# EAGLE design Light_box_v2 (EAGLE 9.6.2)
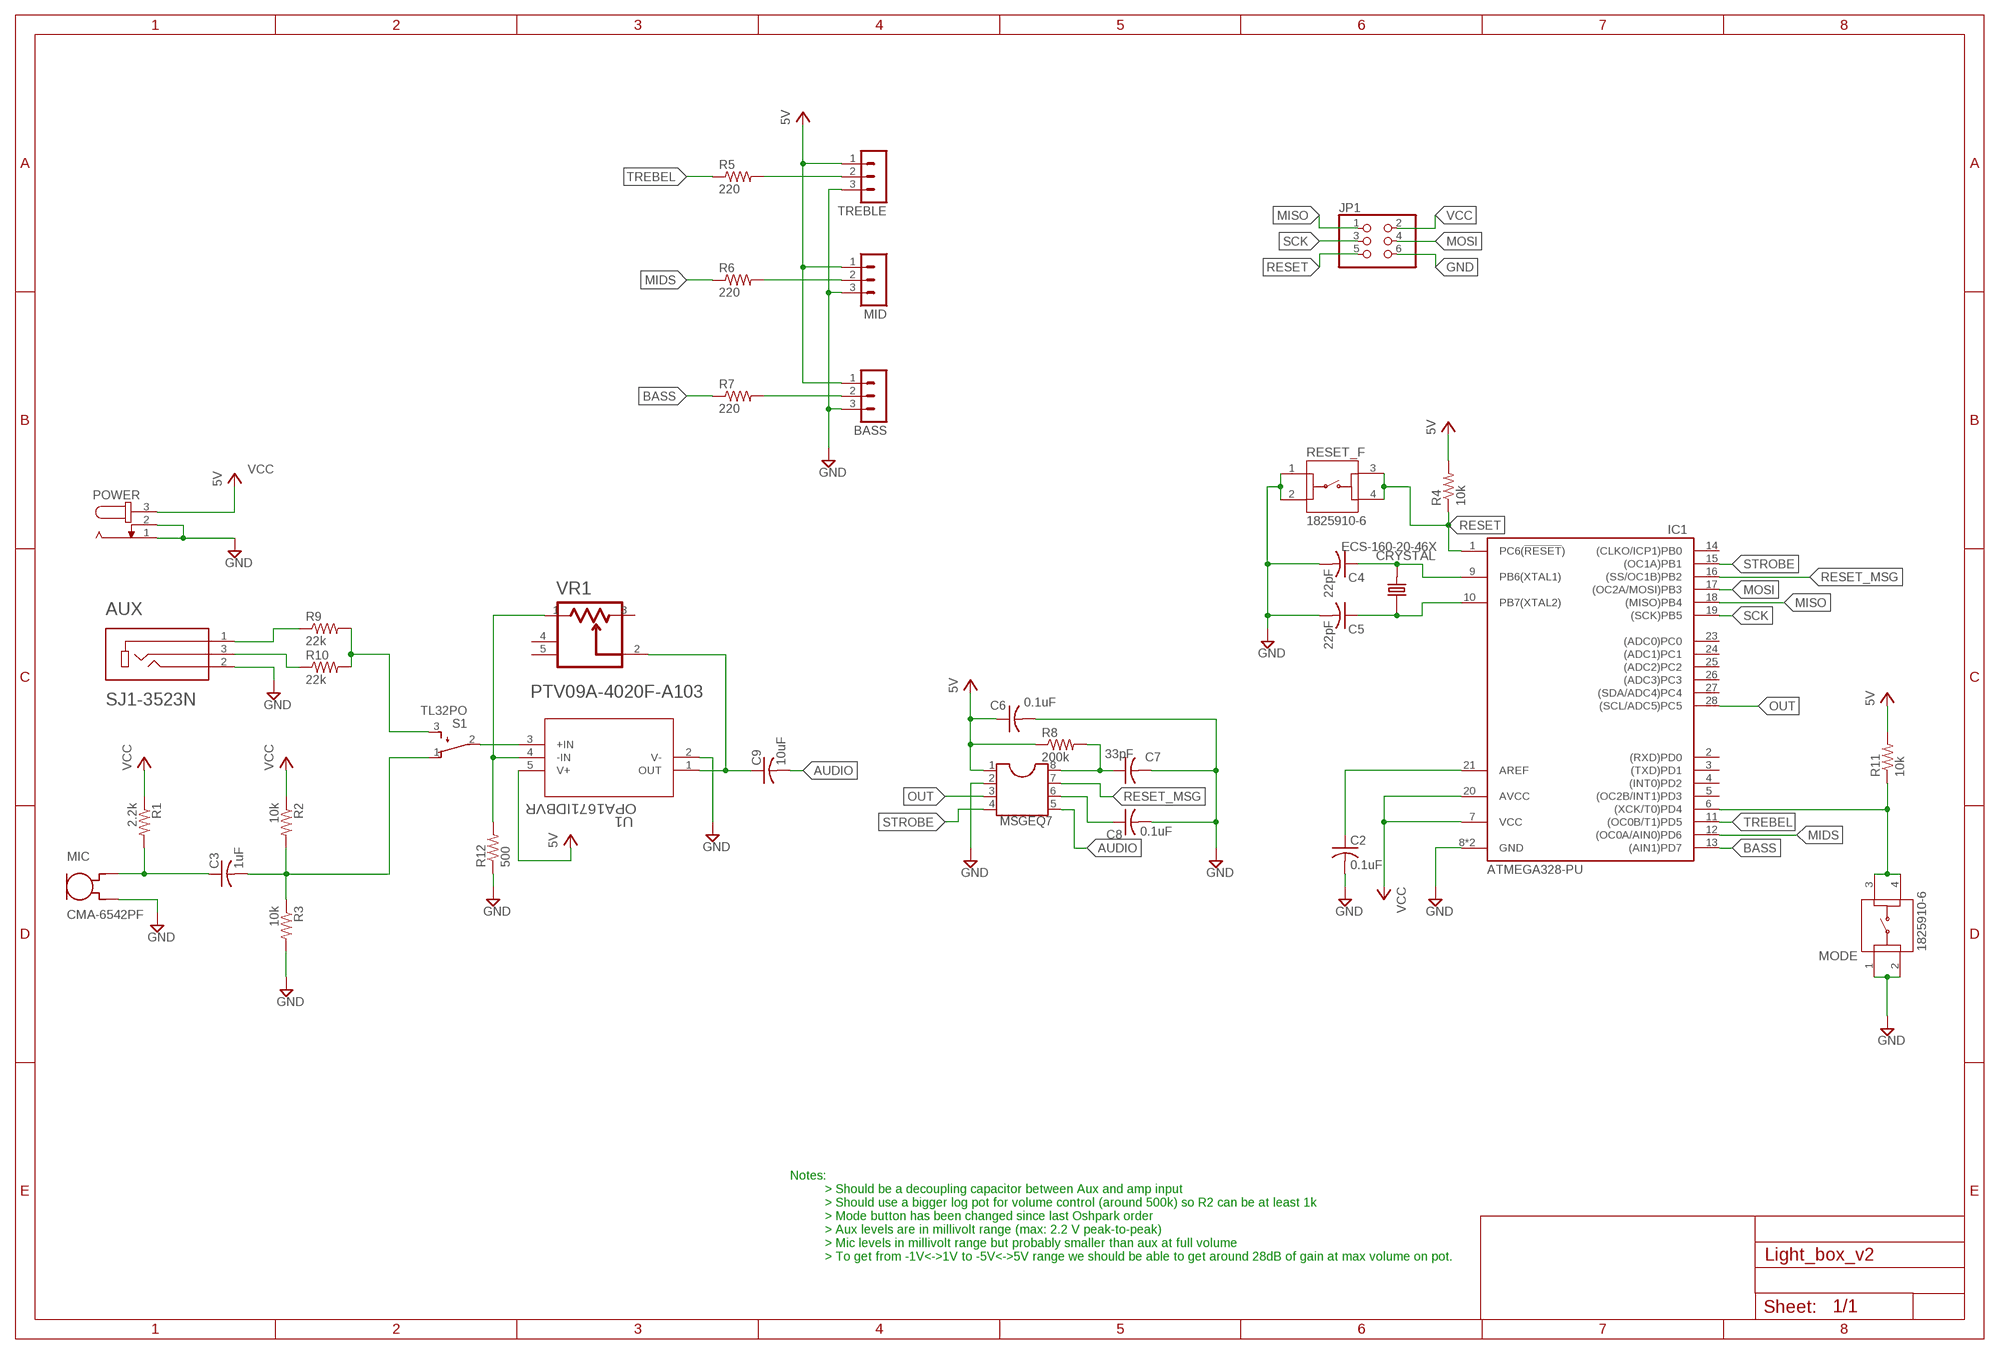
[diagram p0: schematic, sheet 1]

## Parts
AUX  SJ1-3523N  [CUI_SJ1-3523N]
BASS  MA03-1  [MA03-1]
C2  0.1uF  C-USC0805  [C0805]
C3  1uF  C-USC0805  [C0805]
C4  22pF  C-USC0805  [C0805]
C5  22pF  C-USC0805  [C0805]
C6  0.1uF  C-USC0805  [C0805]
C7  33pF  C-USC0805  [C0805]
C8  0.1uF  C-USC0805  [C0805]
C9  10uF  C-USC0805  [C0805]
CRYSTAL  ECS-160-20-46X  [XTAL_ECS-160-20-46X]
IC1  ATMEGA328-PU  [DIL28]
JP1  PINHD-2X3  [2X03]
MIC  CMA-6542PF  [CUI_CMA-6542PF]
MID  MA03-1  [MA03-1]
MODE  1825910-6  [SW_1825910-6-4]
MSGEQ7  DIL8  [DIL08]
POWER  JACK-PLUG1  [SPC4078]
R1  2.2k  R-US_R0805  [R0805]
R2  10k  R-US_R0805  [R0805]
R3  10k  R-US_R0805  [R0805]
R4  10k  R-US_R0805  [R0805]
R5  220  R-US_R0805  [R0805]
R6  220  R-US_R0805  [R0805]
R7  220  R-US_R0805  [R0805]
R8  200k  R-US_R0805  [R0805]
R9  22k  R-US_R0805  [R0805]
R10  22k  R-US_R0805  [R0805]
R11  10k  R-US_R0805  [R0805]
R12  500  R-US_R0805  [R0805]
RESET_F  1825910-6  [SW_1825910-6-4]
S1  TL32PO  [TL3XPO]
TREBLE  MA03-1  [MA03-1]
U1  OPA1671IDBVR  [SOT23-DBV5_TEX]
VR1  BOURNS_PTV09A-4020F-A103BOURNS_PTV09A-4020F-A103_0_0  [BOURNS_PTV09A-4020F-A103_0]

## Nets
AUDIO: C9.2 MSGEQ7.5
BASS: IC1.13((AIN1)PD7) R7.1
GND: AUX.2 BASS.3 C2.2 C4.2 C5.2 C6.2 C7.2 C8.2 IC1.8(GND) IC1.22(GND) JP1.6 MIC.GND MID.3 MODE.1 MODE.2 MSGEQ7.2 POWER.1 POWER.2 R3.2 R12.1 RESET_F.1 RESET_F.2 TREBLE.3 U1.2(V-)
MIDS: IC1.12((OC0A/AIN0)PD6) R6.1
MISO: IC1.18((MISO)PB4) JP1.1
MOSI: IC1.17((OC2A/MOSI)PB3) JP1.4
N$1: C3.1 MIC.OUT R1.2
N$2: C3.2 R2.2 R3.1 S1.1(O)
N$3: AUX.1 R9.1
N$4: C4.1 CRYSTAL.2 IC1.9(PB6(XTAL1))
N$5: C5.1 CRYSTAL.1 IC1.10(PB7(XTAL2))
N$6: R5.2 TREBLE.2
N$7: C9.1 U1.1(OUT) VR1.2
N$8: MID.2 R6.2
N$9: BASS.2 R7.2
N$10: C7.1 MSGEQ7.8 R8.2
N$11: C8.1 MSGEQ7.6
N$12: AUX.3 R10.1
N$13: R12.2 U1.4(-IN) VR1.1
N$14: R9.2 R10.2 S1.3(S)
N$15: C2.1 IC1.21(AREF)
N$16: S1.2(P) U1.3(+IN)
N$22: IC1.6((XCK/T0)PD4) MODE.3 MODE.4 R11.1
OUT: IC1.28((SCL/ADC5)PC5) MSGEQ7.3
RESET: IC1.1(PC6(!RESET!)) JP1.5 R4.1 RESET_F.3 RESET_F.4
RESET_MSG: IC1.16((SS/OC1B)PB2) MSGEQ7.7
SCK: IC1.19((SCK)PB5) JP1.3
STROBE: IC1.15((OC1A)PB1) MSGEQ7.4
TREBEL: IC1.11((OC0B/T1)PD5) R5.1
VCC: BASS.1 C6.1 IC1.7(VCC) IC1.20(AVCC) JP1.2 MID.1 MSGEQ7.1 POWER.3 R1.1 R2.1 R4.2 R8.1 R11.2 TREBLE.1 U1.5(V+) ; supply symbol labelled 5V
Unconnected: IC1.2((RXD)PD0) IC1.3((TXD)PD1) IC1.4((INT0)PD2) IC1.5((OC2B/INT1)PD3) IC1.14((CLKO/ICP1)PB0) IC1.23((ADC0)PC0) IC1.24((ADC1)PC1) IC1.25((ADC2)PC2) IC1.26((ADC3)PC3) IC1.27((SDA/ADC4)PC4) VR1.3 VR1.4(MNT_1) VR1.5(MNT_2)

## Notes on the sheet
- Notes:
            > Should be a decoupling capacitor between Aux and amp input
            > Should use a bigger log pot for volume control (around 500k) so R2 can be at least 1k
            > Mode button has been changed since last Oshpark order
            > Aux levels are in millivolt range (max: 2.2 V peak-to-peak)
            > Mic levels in millivolt range but probably smaller than aux at full volume
            > To get from -1V<->1V to -5V<->5V range we should be able to get around 28dB of gain at max volume on pot.

## Library data of the parts
AUX = SJ1-3523N:SJ1-3523N: 3.5 mm Right-Angle Stereo Jack, 3 Pin PCB Mount, Non-Threaded; MANUFACTURER: CUI; PARTREV: 1.02; STANDARD: Manufacturer recommendation
BASS MID TREBLE = con-lstb:MA03-1: PIN HEADER; OC_FARNELL: unknown; OC_NEWARK: unknown
C2-C9 = rcl:C-US: CAPACITOR, American symbol; SPICEPREFIX: C
CRYSTAL = ECS-160-20-46X:ECS-160-20-46X: QUARTZ CRYSTAL T/H; DESCRIPTION: 16MHz ±30ppm Crystal 20pF 50 Ohms HC-46/X; DIGI-KEY_PART_NUMBER: XC1759-ND; DIGIKEY-PURCHASE-URL: https://snapeda.com/shop?store=DigiKey&id=628017; MF: ECS Inc.; MOUSER-PURCHASE-URL: https://snapeda.com/shop?store=Mouser&id=628017; MP: ECS-160-20-46X; PACKAGE: HC46/X ECS International
IC1 = ATMEGA328-PU:ATMEGA328-PU: Atmel ATmega48/88/168/328 AVR Microcontroller; DESCRIPTION: IC MCU 8BIT 32KB FLASH 28DIP; DIGIKEY-PURCHASE-URL: https://snapeda.com/shop?store=DigiKey&id=4833845; MF: Microchip Technology; MOUSER-PURCHASE-URL: https://snapeda.com/shop?store=Mouser&id=4833845; MP: ATMEGA328-PU; PACKAGE: None
JP1 = pinhead:PINHD-2X3: PIN HEADER
MIC = CMA-6542PF:CMA-6542PF: 9.7 mm, Omnidirectional, PCB Mount, 4.5 Vdc, Electret Condenser Microphone; CUI_PURCHASE_URL: https://www.cuidevices.com/product/audio/microphones/electret-condenser-microphones/cma-6542pf?utm_source=snapeda.com&utm_medium=referral&utm_campaign=snapedaBOM; DESCRIPTION: 9.7 mm, Omnidirectional, PCB Mount, 4.5 Vdc, Electret Condenser Microphone; DIGI-KEY_PART_NUMBER: 102-1720-ND; DIGIKEY-PURCHASE-URL: https://snapeda.com/shop?store=DigiKey&id=316835; MF: CUI Devices; MOUSER-PURCHASE-URL: https://snapeda.com/shop?store=Mouser&id=316835; MP: CMA-6542PF; PACKAGE: CUI Inc.
MODE RESET_F = 1825910-6:1825910-6: Switch Tactile OFF (ON) SPST Round Button PC Pins 0.05A 24VDC 100000Cycles 1.57N Thru-Hole Loose; COMMENT: 1825910-6; CONFIGURATION_POLE-THROW: Single Pole - Single Throw; CONTACT_CURRENT_RATING: 50 mA; DESCRIPTION: Switch Push Button OFF (ON) SPST Round Button 0.05A 24VDC Momentary Contact PC Pins Thru-Hole; DIGI-KEY_PART_NUMBER: 450-1650-ND; DIGIKEY-PURCHASE-URL: https://snapeda.com/shop?store=DigiKey&id=424522; EU_ROHS_COMPLIANCE: Compliant; MF: TE Connectivity; MP: 1825910-6; PACKAGE: None
MSGEQ7 = ic-package:DIL8: Dual In Line / Socket
POWER = con-jack:JACK-PLUG: DC POWER JACK Power Jack, DC, Right Angle, Through Hole, Rated 5A at 16VDC, PC Terminals Distributor: Farnell (www.Farnell.de) Drawing: 84N1161.pdf / 84N1162.pdf Manufacturer: SPC Technology (www.spctechnology.com) Type: SPC4077 / SPC 4078; OC_FARNELL: unknown; OC_NEWARK: unknown
R1-R12 = rcl:R-US_: RESISTOR, American symbol; SPICEPREFIX: R
S1 = switch:TL32PO: TINY SWITCH ON - MOM Source: http://www2.produktinfo.conrad.com/datenblaetter/700000-724999/705152-da-01-de-Subminiaturschalter_TL_36YO.pdf
U1 = my_audio_amp:OPA1671IDBVR; BUILT_BY: EMA_Cory; COPYRIGHT: Copyright (C) 2018 Accelerated Designs. All rights reserved; DATASHEET: https://www.ti.com/lit/ds/symlink/opa1671.pdf; MANUFACTURER_PART_NUMBER: OPA1671IDBVR; SOURCELIBRARY: TI_2020-03-25; VENDOR: Texas Instruments
VR1 = Bourns - PTV09A-4020F-A103:BOURNS_PTV09A-4020F-A103: PTV09 series 9mm Potentiometer; CENTROID_NOT_SPECIFIED: No; DATASHEET: http://www.bourns.com/data/global/pdfs/PTV09.pdf; DIGIKEY_DESCRIPTION: RES POT 10K OHM 1/20W CARBON LOG; DIGIKEY_PART_NUMBER: PTV09A-4020F-A103-ND; LEAD_FREE: yes; MF: Bourns; MFG_PACKAGE_IDENT: PTV09A-4; MOUSER_PART_NUMBER: 652-PTV09A-4020FA103; MPN: PTV09A-4020F-A103; PACKAGE: POT_PTH_9MMO; POWER: 50mW; PREFIX: VR; RESISTANCE: 10k; ROHS: yes; TEMPERATURE_RANGE_HIGH: +50°C; TEMPERATURE_RANGE_LOW: -10°C

## Board
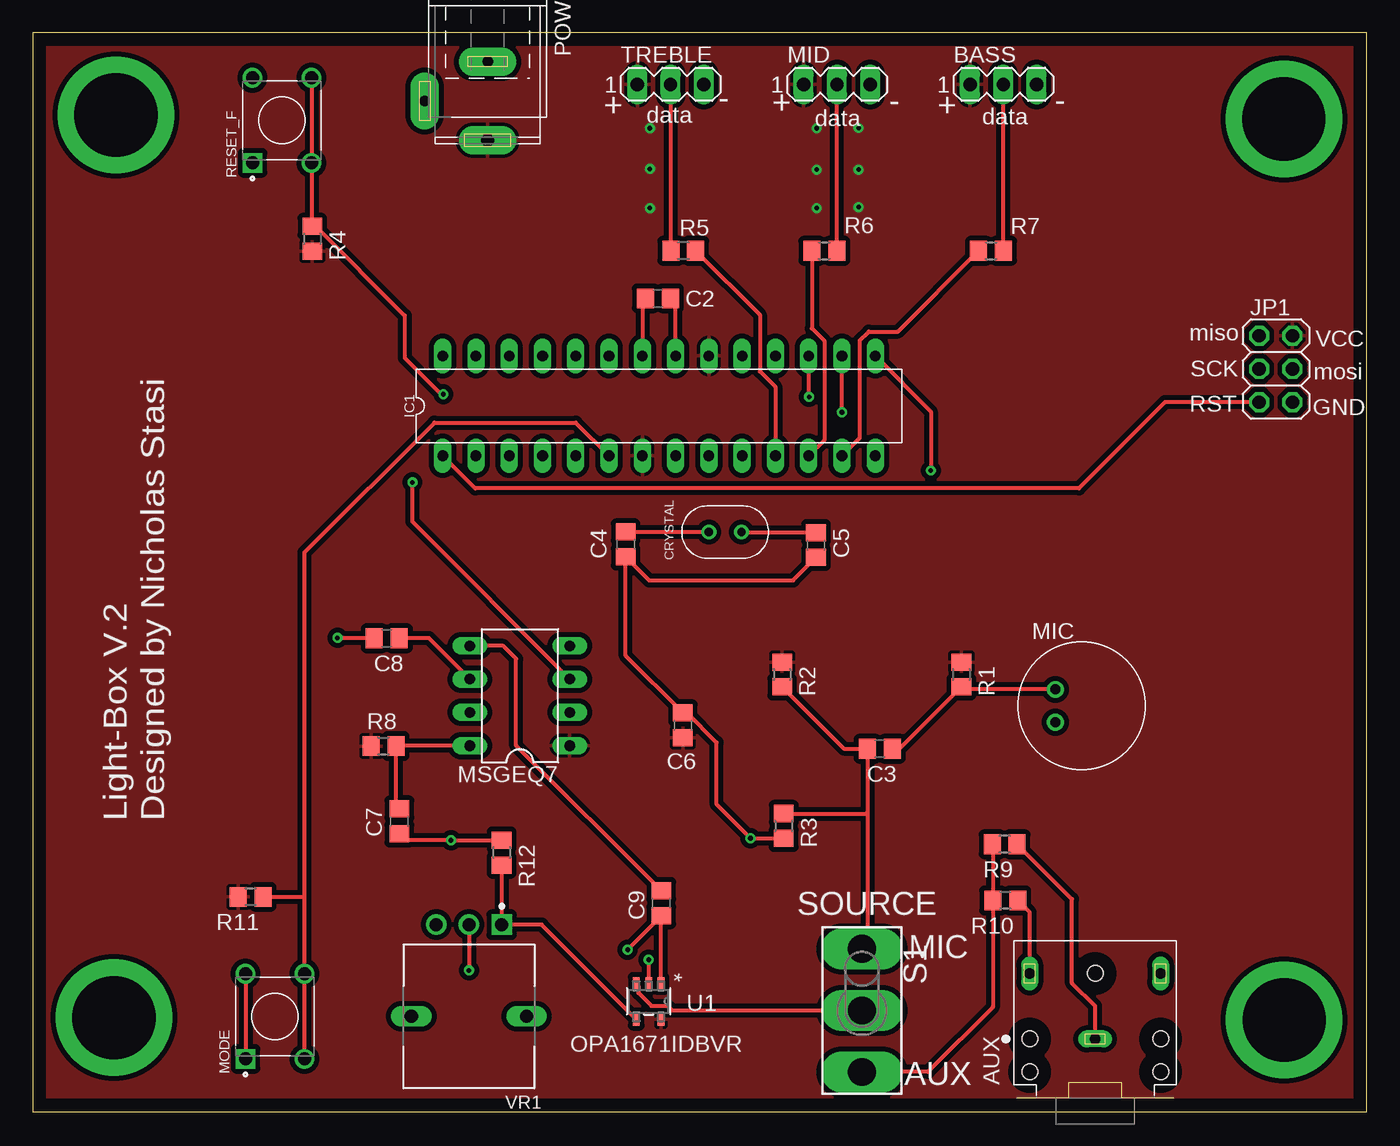
[diagram p1: board, top side]
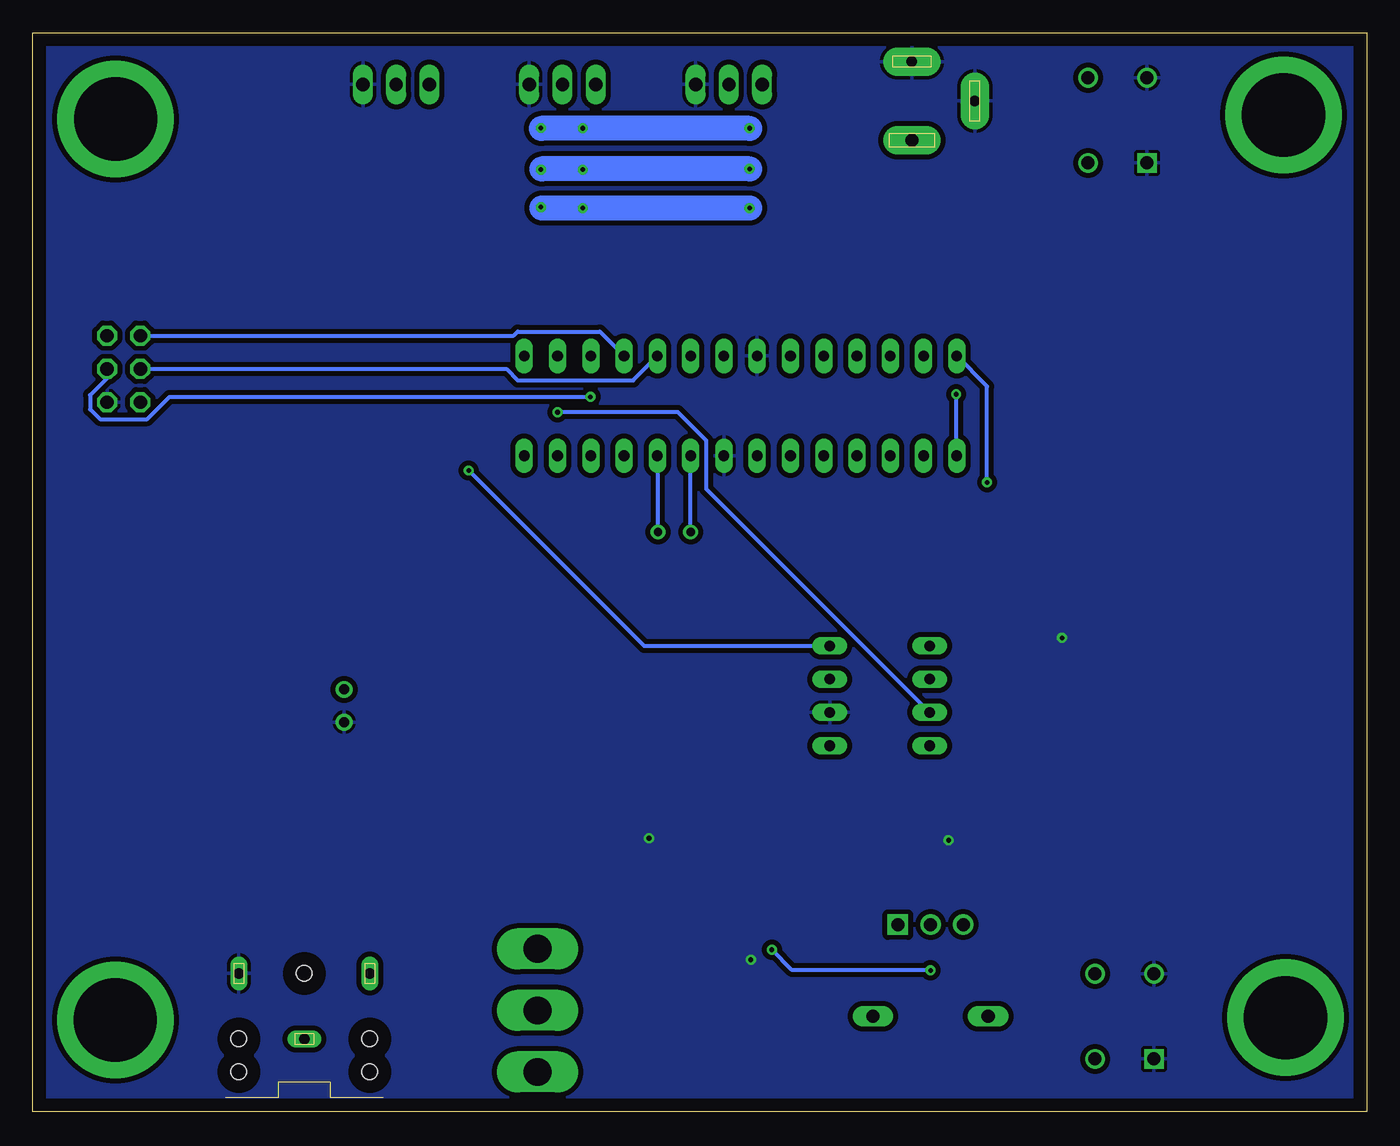
[diagram p2: board, bottom side, seen from below]

Size 101.83 x 82.32 mm. Coordinates in mm from the lower left corner, seen from the top.
Outline: 0,0 101.83,0 101.83,82.32 0,82.32 0,0
Copper layers (1*16): Top 0.035mm / dielectric 1.5mm / Bottom 0.035mm
Design rules "default *": minimum track width 6mil, minimum drill 0.35mm, track to track 15mil, track to pad 15mil, pad to pad 15mil, via to via 15mil, smd to smd 15mil, copper to edge 40mil, drill to drill 6mil, minimum pad ring 10mil, minimum via ring 8mil, stop-mask expansion 4mil, vias tented up to drill 0mil, thermal gap 10mil

### Footprints (pad centres in the part's own frame; a part is rotated, then mirrored left to right if it is on the bottom)
CUI_SJ1-3523N = drill 0.8 long: 1 0,0; 2 5,-5; 3 5,5 | hole 1.2: -2.5,5; 0,5; 5,0; -2.5,-5; 0,-5
MA03-1 = drill 1.016 long: 1 -2.54,0; 2 0,0; 3 2.54,0
C0805 = smd 1.3 x 1.5: 1 -0.95,0; 2 0.95,0
XTAL_ECS-160-20-46X = drill 0.63 pad 1.03: 1 -1.25,0; 2 1.25,0
DIL28 = drill 0.813 long: 1 -3.81,16.51; 2 -3.81,13.97; 3 -3.81,11.43; 4 -3.81,8.89; 5 -3.81,6.35; 6 -3.81,3.81; 7 -3.81,1.27; 8 -3.81,-1.27; 9 -3.81,-3.81; 10 -3.81,-6.35; 11 -3.81,-8.89; 12 -3.81,-11.43; 13 -3.81,-13.97; 14 -3.81,-16.51; 15 3.81,-16.51; 16 3.81,-13.97; 17 3.81,-11.43; 18 3.81,-8.89; 19 3.81,-6.35; 20 3.81,-3.81; 21 3.81,-1.27; 22 3.81,1.27; 23 3.81,3.81; 24 3.81,6.35; 25 3.81,8.89; 26 3.81,11.43; 27 3.81,13.97; 28 3.81,16.51
2X03 = drill 1.016 octagon: 1 -2.54,-1.27; 2 -2.54,1.27; 3 0,-1.27; 4 0,1.27; 5 2.54,-1.27; 6 2.54,1.27
CUI_CMA-6542PF = drill 0.77: GND -2,-1.25; OUT -2,1.25
SW_1825910-6-4 = drill 0.99 square: 1 -3.25,2.25 | drill 0.99: 2 3.25,2.25; 3 -3.25,-2.25; 4 3.25,-2.25
DIL08 = drill 0.813 long: 1 -3.81,-3.81; 2 -1.27,-3.81; 3 1.27,-3.81; 4 3.81,-3.81; 5 3.81,3.81; 6 1.27,3.81; 7 -1.27,3.81; 8 -3.81,3.81
SPC4078 = drill 0.8 pad 2.184 long: 1 -3,0; 2 0,-4.8 | drill 1 pad 2.184 long: 3 3,0
R0805 = smd 1.3 x 1.5: 1 -0.95,0; 2 0.95,0
TL3XPO = drill 2.108 pad 2.794 long: 1 -4.699,0; 2 0,0; 3 4.699,0
SOT23-DBV5_TEX = smd 0.978 x 0.508: 1 -1.365,0.95; 2 -1.365,0; 3 -1.365,-0.95; 4 1.365,-0.95; 5 1.365,0.95
BOURNS_PTV09A-4020F-A103_0 = drill 1 pad 1.55 square: 1 -2.5,-7 | drill 1 pad 1.55: 2 0,-7; 3 2.5,-7 | drill 1 pad 1.55 long: 4 -4.4,0; 5 4.4,0

### Placement (x,y rotation side)
AUX  81.1,5.54 90 top
BASS  74.09,78.38 0 top
C2  47.73,62.05 180 top
C3  64.67,27.69 180 top
C4  45.26,43.28 270 top
C5  59.79,43.23 270 top
C6  49.63,29.46 90 top
C7  27.99,22.15 270 top
C8  27.03,36.12 180 top
C9  47.98,15.9 90 top
CRYSTAL  52.86,44.22 180 top
IC1  47.8,53.85 90 top
JP1  94.89,56.67 270 top
MIC  80.06,30.96 0 top
MID  61.39,78.38 0 top
MODE  18.49,7.26 90 top
MSGEQ7  37.19,31.72 90 top
POWER  34.72,77.11 270 top
R1  70.89,33.35 270 top
R2  57.2,33.35 270 top
R3  57.33,21.79 270 top
R4  21.34,66.6 270 top
R5  49.66,65.68 180 top
R6  60.43,65.68 0 top
R7  73.15,65.68 0 top
R8  26.77,27.89 0 top
R9  74.19,20.4 180 top
R10  74.24,16.1 180 top
R11  16.64,16.38 180 top
R12  35.79,19.76 270 top
RESET_F  19.02,75.64 90 top
S1  63.3,7.72 270 top
TREBLE  48.69,78.38 0 top
U1  47.02,8.41 270 top
VR1  33.3,7.26 180 top

### Tracks (layer width: path | path; a pad name or v marks a point on that pad's centre or on a via)
AUDIO
  Top 0.305: C9.2 36.91,27.92 36.91,34.54 35.92,35.53 MSGEQ7.5
BASS
  Top 0.305: IC1.13 63.12,51.38 63.12,58.81 63.82,59.51 66.03,59.51 R7.1
GND  (via drill 0.35)
  Top 0.305: R12.1 31.94,20.71 v31.93,20.7 28.49,20.7 C7.2 | v23.27,36.14 26.05,36.14 C8.2 | R3.2 v54.79,20.85 52.2,23.44 52.2,28.15 49.94,30.41 C6.2 45.26,34.78 C4.2 47.06,40.54 58.05,40.54 C5.2 | v47.02,11.58 U1.2 | C2.2 46.53,61.81 IC1.22 | MODE.2 MODE.1
  pour Bottom: -25.43,96.77 -25.43,0.86 -4.72,-19.84 104.37,-19.84 123.01,-1.19 123.01,87.43 113.67,96.77
MIDS
  Top 0.305: R6.1 59.48,59.76 60.43,58.81 60.43,51.23 IC1.12
MISO
  Bottom 0.305: JP1.1 65.11,59.21 64.81,59.51 58.55,59.51 IC1.18
MOSI  (via drill 0.35)
  Top 0.305: v59.26,54.53 59.26,57.63 IC1.17
  Bottom 0.305: v59.26,54.53 91.39,54.53 93.09,52.83 96.7,52.83 97.46,53.59 97.46,54.66 96.16,55.96 JP1.4
N$1
  Top 0.305: MIC.OUT 71.08,32.21 R1.2 66.18,27.69 C3.1
N$2
  Top 0.305: 63.72,22.63 C3.2 61.91,27.69 R2.2 | 63.72,22.63 63.72,12.84 S1.1 | R3.1 63.61,22.74 63.72,22.63
N$3
  Top 0.305: AUX.1 81.1,8.04 79.33,9.8 79.33,16.21 R9.1
N$4
  Top 0.305: C4.1 CRYSTAL.2
  Bottom 0.305: CRYSTAL.2 IC1.9
N$5
  Top 0.305: C5.1 54.15,44.18 CRYSTAL.1
  Bottom 0.305: CRYSTAL.1 54.11,49.99 IC1.10
N$6
  Top 0.305: R5.2 48.71,78.37 TREBLE.2
N$7  (via drill 0.35)
  Top 0.305: VR1.2 v33.3,10.77 | U1.1 47.97,14.89 | 47.97,14.89 47.98,14.91 C9.1 | v45.41,12.34 47.97,14.89
  Bottom 0.305: v33.3,10.77 33.32,10.8 43.87,10.8 v45.41,12.34
N$8
  Top 0.305: R6.2 61.38,78.37 MID.2
N$9
  Top 0.305: R7.2 BASS.2
N$10
  Top 0.305: MSGEQ7.8 27.75,27.91 | 27.75,27.91 R8.2 | C7.1 27.75,23.34 27.75,27.91
N$11
  Top 0.305: MSGEQ7.6 30.25,36.12 C8.1
N$12
  Top 0.305: AUX.3 76.1,15.2 R10.1
N$13
  Top 0.305: U1.4 38.84,14.26 VR1.1 35.8,18.8 R12.2
N$14
  Top 0.305: S1.3 68.35,3.02 73.29,7.97 R10.2 73.29,20.35 R9.2
N$15
  Top 0.305: IC1.21 49.07,61.66 C2.1
N$16
  Top 0.305: U1.3 46.23,9.61 46.23,9.06 47.23,8.06 48.44,8.06 48.78,7.72 S1.2
N$18  (via drill 6.35 pad 8.89)
  other vias: 95.5,75.74
N$19  (via drill 6.35 pad 8.89)
  other vias: 6.35,76.05
N$20  (via drill 6.35 pad 8.89)
  other vias: 6.2,7.16
N$21  (via drill 6.35 pad 8.89)
  other vias: 95.53,6.98
N$22
  Top 0.305: IC1.6 41.45,52.58 30.66,52.58 20.74,42.66 20.74,16.43 | MODE.3 MODE.4 20.74,16.43 | R11.1 20.69,16.38 20.74,16.43
OUT  (via drill 0.35)
  Top 0.305: MSGEQ7.3 28.98,45.01 v28.98,48.01
  Bottom 0.305: v28.98,48.01 28.98,55.35 IC1.28
RESET  (via drill 0.35)
  Top 0.305: JP1.5 86.44,54.13 79.86,47.55 33.78,47.55 IC1.1 | v31.34,54.74 31.17,54.74 28.4,57.51 28.4,60.74 21.59,67.55 R4.1 21.27,67.61 RESET_F.3 RESET_F.4
  Bottom 0.305: v31.34,54.74 31.34,50.09 IC1.1
RESET_MSG  (via drill 0.35)
  Top 0.305: v61.77,53.37 IC1.16
  Bottom 0.305: MSGEQ7.7 50.42,47.5 50.42,51.19 52.59,53.37 v61.77,53.37
SCK
  Bottom 0.305: JP1.3 65.67,56.67 64.81,55.8 56.01,55.8 IC1.19
STROBE  (via drill 0.35)
  Top 0.305: IC1.15 68.55,53.42 v68.55,48.92
  Bottom 0.305: v68.55,48.92 55.17,35.53 MSGEQ7.4
TREBEL
  Top 0.305: R5.1 55.5,60.79 55.5,56.49 56.69,55.3 IC1.11
VCC  (via drill 0.35)
  Bottom 0.305: 63.02,75.03 v63.04,75.06 | 62.99,71.93 v63.04,71.88 | 62.97,68.94 v63.04,69.01
  Bottom 1.905: v47.12,75.03 63.02,75.03 | v47.12,71.93 62.99,71.93 | v47.12,68.94 62.97,68.94
  other vias: 59.84,75.03 59.84,71.88 59.84,68.94
  pour Top: -28.73,104.34 118.21,104.34 134.92,87.63 134.92,-10.41 111.38,-33.96 -12.6,-33.96 -38.89,-7.67 -38.89,94.18

### Text on the board
tPlace: - | + | data | + | - | + | - | data | data | miso | VCC | SCK | mosi | RST | GND | Light-Box V.2 / Designed by Nicholas Stasi | SOURCE | MIC | AUX